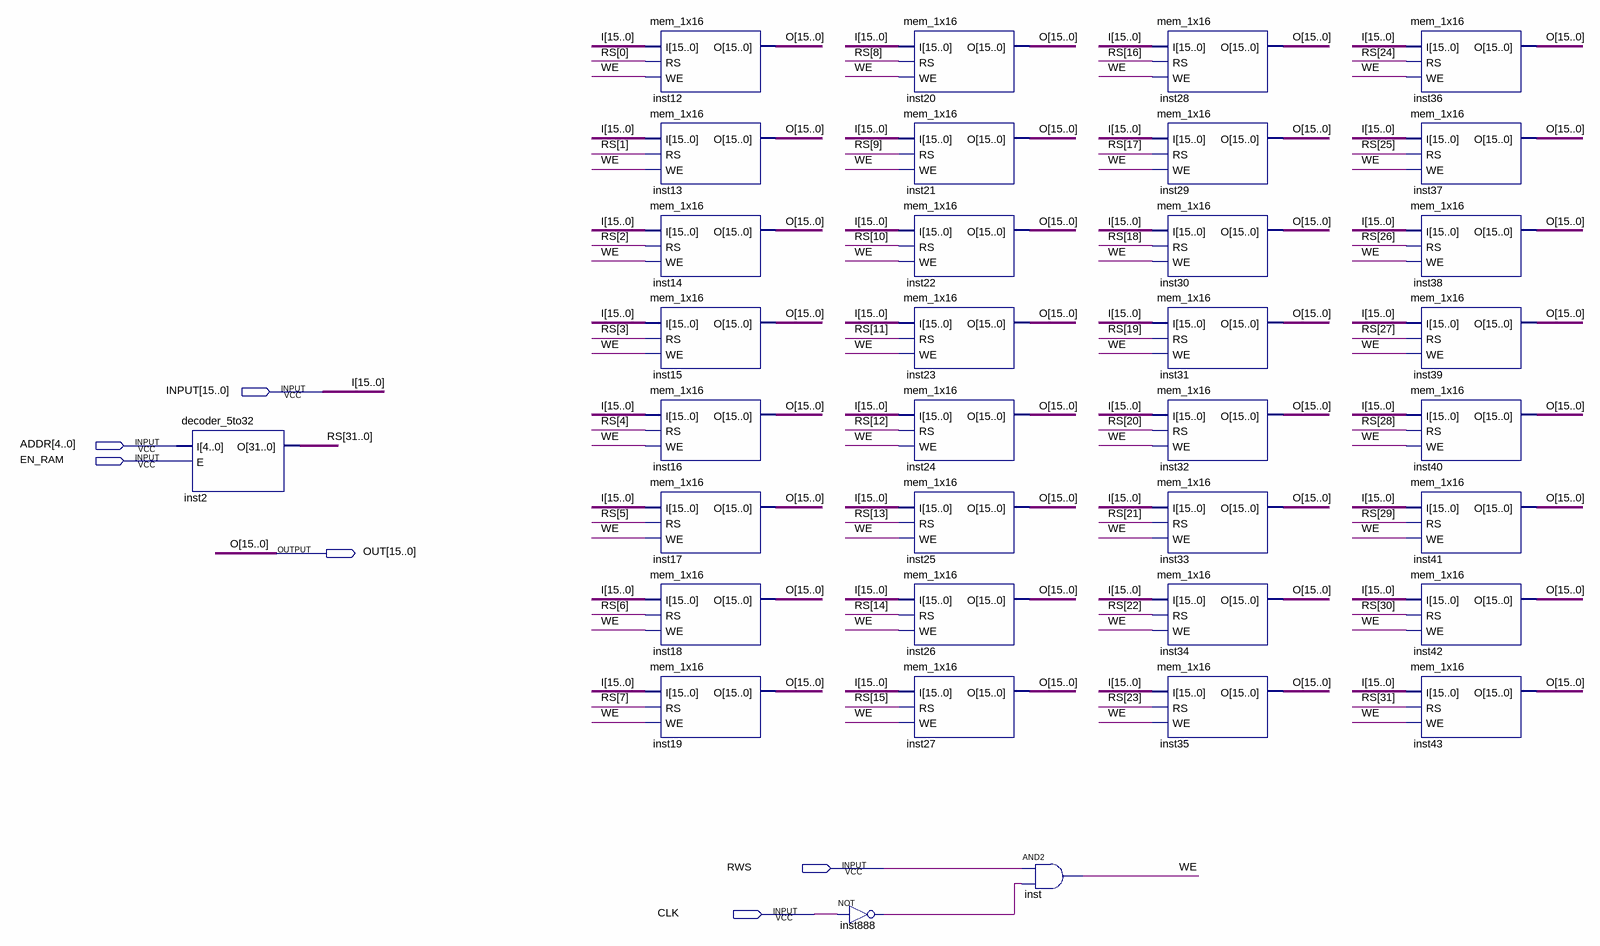
[diagram p0: schematic sheet]
// Quartus schematic mem_32x16.bdf as structural Verilog: 35 symbols, 6 pins
module mem_32x16 (
  input  [15:0] INPUT,
  input  [4:0] ADDR,
  input  EN_RAM,
  input  RWS,
  input  CLK,
  output [15:0] OUT
);

  wire inst888_out, WE;
  wire [31:0] RS;

  decoder_5to32 inst2 (.I(ADDR), .E(EN_RAM), .O(RS));
  mem_1x16 inst12 (.I(INPUT), .RS(RS[0]), .WE(WE), .O(OUT));
  mem_1x16 inst13 (.I(INPUT), .RS(RS[1]), .WE(WE), .O(OUT));
  mem_1x16 inst14 (.I(INPUT), .RS(RS[2]), .WE(WE), .O(OUT));
  mem_1x16 inst15 (.I(INPUT), .RS(RS[3]), .WE(WE), .O(OUT));
  mem_1x16 inst16 (.I(INPUT), .RS(RS[4]), .WE(WE), .O(OUT));
  mem_1x16 inst17 (.I(INPUT), .RS(RS[5]), .WE(WE), .O(OUT));
  mem_1x16 inst18 (.I(INPUT), .RS(RS[6]), .WE(WE), .O(OUT));
  mem_1x16 inst19 (.I(INPUT), .RS(RS[7]), .WE(WE), .O(OUT));
  not inst888 (inst888_out, CLK);
  mem_1x16 inst20 (.I(INPUT), .RS(RS[8]), .WE(WE), .O(OUT));
  mem_1x16 inst21 (.I(INPUT), .RS(RS[9]), .WE(WE), .O(OUT));
  mem_1x16 inst22 (.I(INPUT), .RS(RS[10]), .WE(WE), .O(OUT));
  mem_1x16 inst23 (.I(INPUT), .RS(RS[11]), .WE(WE), .O(OUT));
  mem_1x16 inst24 (.I(INPUT), .RS(RS[12]), .WE(WE), .O(OUT));
  mem_1x16 inst25 (.I(INPUT), .RS(RS[13]), .WE(WE), .O(OUT));
  mem_1x16 inst26 (.I(INPUT), .RS(RS[14]), .WE(WE), .O(OUT));
  mem_1x16 inst27 (.I(INPUT), .RS(RS[15]), .WE(WE), .O(OUT));
  and inst (WE, RWS, inst888_out);
  mem_1x16 inst28 (.I(INPUT), .RS(RS[16]), .WE(WE), .O(OUT));
  mem_1x16 inst29 (.I(INPUT), .RS(RS[17]), .WE(WE), .O(OUT));
  mem_1x16 inst30 (.I(INPUT), .RS(RS[18]), .WE(WE), .O(OUT));
  mem_1x16 inst31 (.I(INPUT), .RS(RS[19]), .WE(WE), .O(OUT));
  mem_1x16 inst32 (.I(INPUT), .RS(RS[20]), .WE(WE), .O(OUT));
  mem_1x16 inst33 (.I(INPUT), .RS(RS[21]), .WE(WE), .O(OUT));
  mem_1x16 inst34 (.I(INPUT), .RS(RS[22]), .WE(WE), .O(OUT));
  mem_1x16 inst35 (.I(INPUT), .RS(RS[23]), .WE(WE), .O(OUT));
  mem_1x16 inst36 (.I(INPUT), .RS(RS[24]), .WE(WE), .O(OUT));
  mem_1x16 inst37 (.I(INPUT), .RS(RS[25]), .WE(WE), .O(OUT));
  mem_1x16 inst38 (.I(INPUT), .RS(RS[26]), .WE(WE), .O(OUT));
  mem_1x16 inst39 (.I(INPUT), .RS(RS[27]), .WE(WE), .O(OUT));
  mem_1x16 inst40 (.I(INPUT), .RS(RS[28]), .WE(WE), .O(OUT));
  mem_1x16 inst41 (.I(INPUT), .RS(RS[29]), .WE(WE), .O(OUT));
  mem_1x16 inst42 (.I(INPUT), .RS(RS[30]), .WE(WE), .O(OUT));
  mem_1x16 inst43 (.I(INPUT), .RS(RS[31]), .WE(WE), .O(OUT));

  // Other names for the same wires on the sheet: I[15:0] = INPUT; O[15:0] = OUT
endmodule
